# EAGLE design IoT_wall_1plug (EAGLE 7.3.0)
CNAME: RadikalBytes; CREVISION: 0.1; DESIGNER: Droky
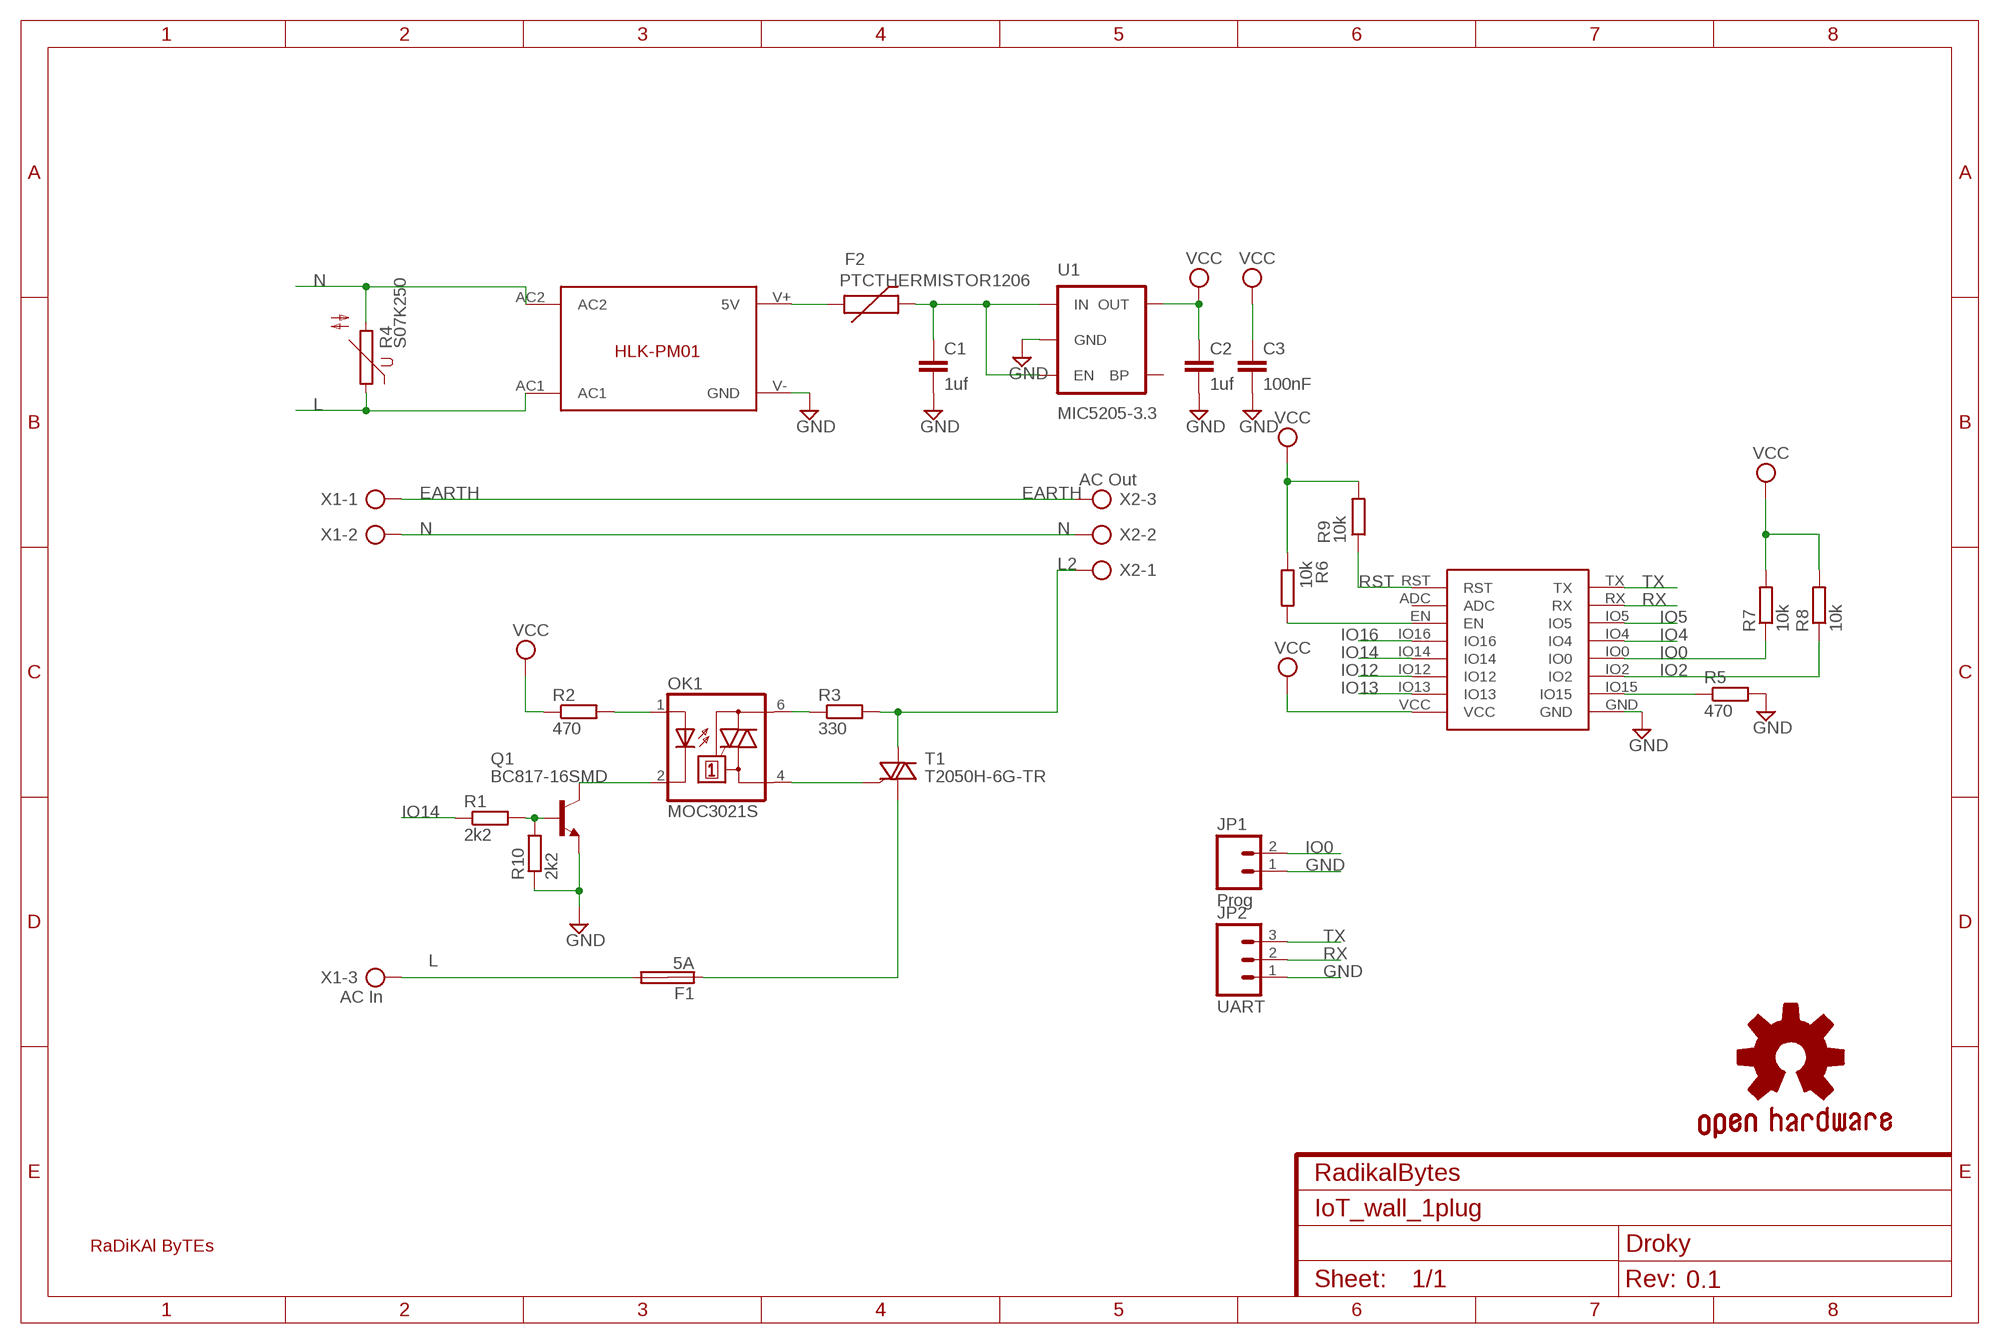
[diagram p0: schematic, sheet 1]

## Parts
C1  1uf  RCL_C-EUC0805K  [RCL_C0805K]
C2  1uf  RCL_C-EUC0805K  [RCL_C0805K]
C3  100nF  RCL_C-EUC0805K  [RCL_C0805K]
F1  5A  SHK20Q  [SHK20Q]
F2  PTCTHERMISTOR1206  SPARKFUN-POWERIC_PTCTHERMISTOR1206  [SPARKFUN-POWERIC_PTC-1206]
GOLD_ORB_SM1  OSHWLOGO_GOLD_ORB_MED  [OSHW1]
JP1  Prog  SPARKFUN-CONNECTORS_M02PTH  [SPARKFUN-CONNECTORS_1X02]
JP2  UART  SPARKFUN-CONNECTORS_M03PTH  [SPARKFUN-CONNECTORS_1X03]
OK1  MOC3021S  MOC3031S  [DIL6-SMD]
Q1  BC817-16SMD  [SOT23-BEC]
R1  2k2  R-EU_R0805  [R0805]
R2  470  R-EU_R0805  [R0805]
R3  330  R-EU_R0805  [R0805]
R4  S07K250  [S07K250]
R5  470  R-EU_R0805  [R0805]
R6  10k  R-EU_R0805  [R0805]
R7  10k  R-EU_R0805  [R0805]
R8  10k  R-EU_R0805  [R0805]
R9  10k  R-EU_R0805  [R0805]
R10  2k2  R-EU_R0805  [R0805]
T1  T2050H-6G-TR  BT136D2PACK  [D2PAK-3]
U1  MIC5205-3.3  SPARKFUN-POWERIC_V_REG_MIC52053.3V  [SPARKFUN-POWERIC_SOT23-5]
U$1  HLK-PM01  [HLK-PM01]
U$2  DAVLIB_ESP8266  [DAVLIB_ESP8266]
U$4  MI_LOGO1.5MM  [MI_LOGO_PEQUEÑO]
X1  AC In  AK500/3  [AK500/3]
X2  AC Out  AK500/3  [AK500/3]

## Nets
EARTH: X1.1 X2.3
GND: C1.2 C2.2 C3.2 JP1.1 JP2.1 Q1.E R5.2 R10.1 U1.2(GND) U$1.V-(GND) U$2.GND
IO0: JP1.2 R7.1 U$2.IO0
IO2: R8.1 U$2.IO2
IO4: U$2.IO4
IO5: U$2.IO5
IO12: U$2.IO12
IO13: U$2.IO13
IO14: R1.1 U$2.IO14
IO16: U$2.IO16
L: F1.2A R4.1 U$1.AC1 X1.3
L2: R3.2 T1.4(A2) X2.1
N: R4.2 U$1.AC2 X1.2 X2.2
N$1: Q1.B R1.2 R10.2
N$2: OK1.1(A) R2.2
N$3: OK1.6(A2) R3.1
N$4: OK1.2(C) Q1.C
N$5: F1.1A T1.1(A1)
N$6: F2.1 U$1.V+(5V)
N$7: OK1.4(A1) T1.3(G)
N$8: C1.1 F2.2 U1.1(IN) U1.3(EN)
N$10: R6.2 U$2.EN
N$12: R5.1 U$2.IO15
RST: R9.1 U$2.RST
RX: JP2.2 U$2.RX
TX: JP2.3 U$2.TX
VCC: C2.1 C3.1 R2.1 R6.1 R7.2 R8.2 R9.2 U1.5(OUT) U$2.VCC
Unconnected: F1.1B F1.2B U1.4(BP) U$2.ADC

## Library data of the parts
C1-C3 = HomeAuto:RCL_C-EU: CAPACITOR, European symbol
F1 = fuse:SHK20Q: FUSE HOLDER 5 x 20 mm, SH contact, E1207 Buerklin 64G6061; OC_FARNELL: unknown; OC_NEWARK: unknown
F2 = HomeAuto:SPARKFUN-POWERIC_PTC: Resettable Fuse PTC Resettable Fuse. Spark Fun Electronics SKU : COM-08357; PROD_ID: RES-08585
GOLD_ORB_SM1 = bfl:OSHWLOGO: These are Open-Source Hardware logos.
JP1 = HomeAuto:SPARKFUN-CONNECTORS_M02: Standard 2-pin 0.1" header. Use with - straight break away headers ( PRT-00116) - right angle break away headers (PRT-00553) - swiss pins (PRT-00743) - machine pins (PRT-00117) - female headers (PRT-00115) Molex polarized connector foot print use with: PRT-08233 with associated crimp pins and housings. 2.54_SCREWTERM for use with PRT-10571. 3.5mm Screw Terminal footprints for PRT-08084 5mm Screw Terminal footprints for use with PRT-08432
JP2 = HomeAuto:SPARKFUN-CONNECTORS_M03: Header 3 Standard 3-pin 0.1" header. Use with straight break away headers (SKU : PRT-00116), right angle break away headers (PRT-00553), swiss pins (PRT-00743), machine pins (PRT-00117), and female headers (PRT-00115). Molex polarized connector foot print use with SKU : PRT-08232 with associated crimp pins and housings.
OK1 = optocoupler:MOC30*: 6-Pin DIP Zero-Cross Optoisolators Triac Driver Output (250/400 Volt Peak) Source: Data sheet <http://www.fairchildsemi.com/ds/MO/MOC3031M.pdf> The old path of data sheet not more available 2013-05-06.; MF: FAIRCHILD SEMICONDUCTOR; MPN: MOC3031SM; OC_FARNELL: unknown; OC_NEWARK: 34C1335
Q1 = transistor-npn:BC817*: NPN Transistor
R1-R3 R5-R10 = rcl:R-EU_: RESISTOR, European symbol
R4 = varistor:S07K250: VARISTOR
T1 = triac:BT136: Triac BT136 series E sensitive gate Source: http://www.nxp.com/acrobat_download/datasheets/BT136_SERIES_E_2.pdf
U1 = HomeAuto:SPARKFUN-POWERIC_V_REG_MIC5205: V_REG MIC5205 Standard 3.3V, 5V, and Adjustable 150mA LDO voltage regulator in SOT-23 layout. Micrel part MIC5205. BP (by-pass) pin is used to lower output noise with 470pF cap, may be left open. On the adjustable version BP is used to set output.; PROD_ID: VREG-00822; VALUE: 3.3V/150mA
U$1 = davLib:HLK-PM01
U$2 = HomeAuto:DAVLIB_ESP8266
U$4 = personal:MI_LOGO
X1 X2 = con-ptr500:AK500/3: CONNECTOR; OC_FARNELL: unknown; OC_NEWARK: unknown

## Board
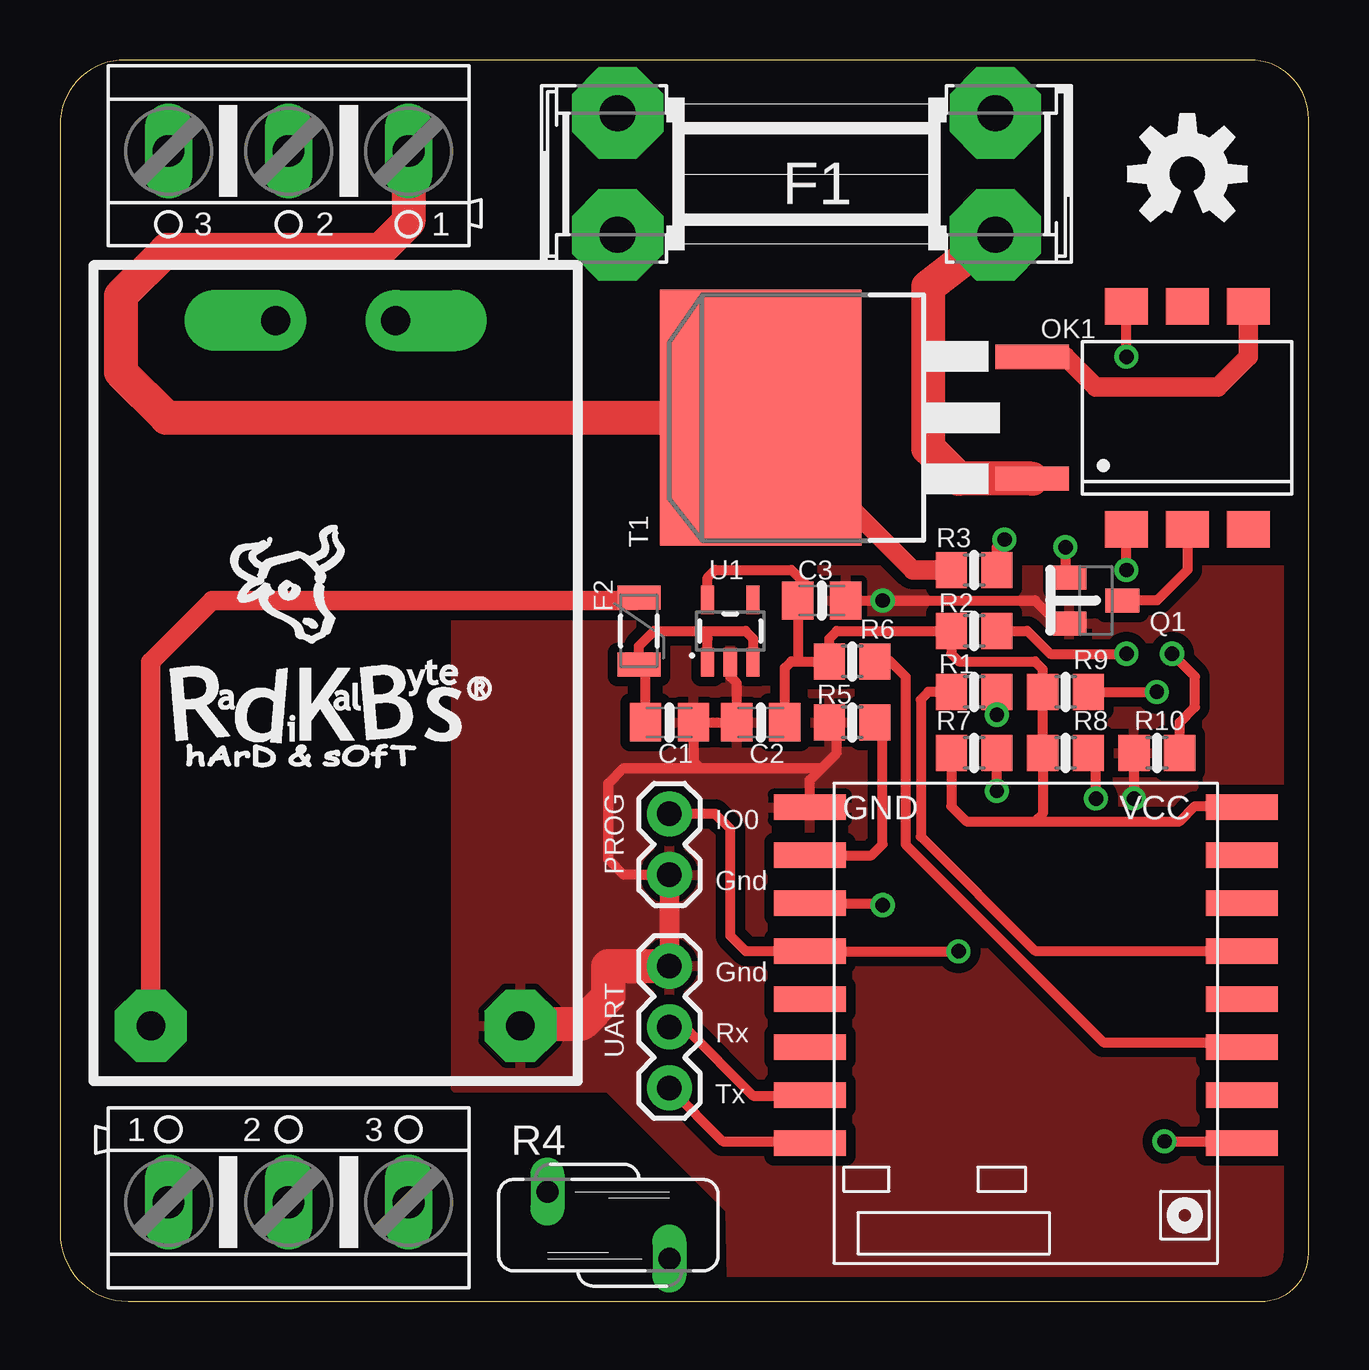
[diagram p1: board, top side]
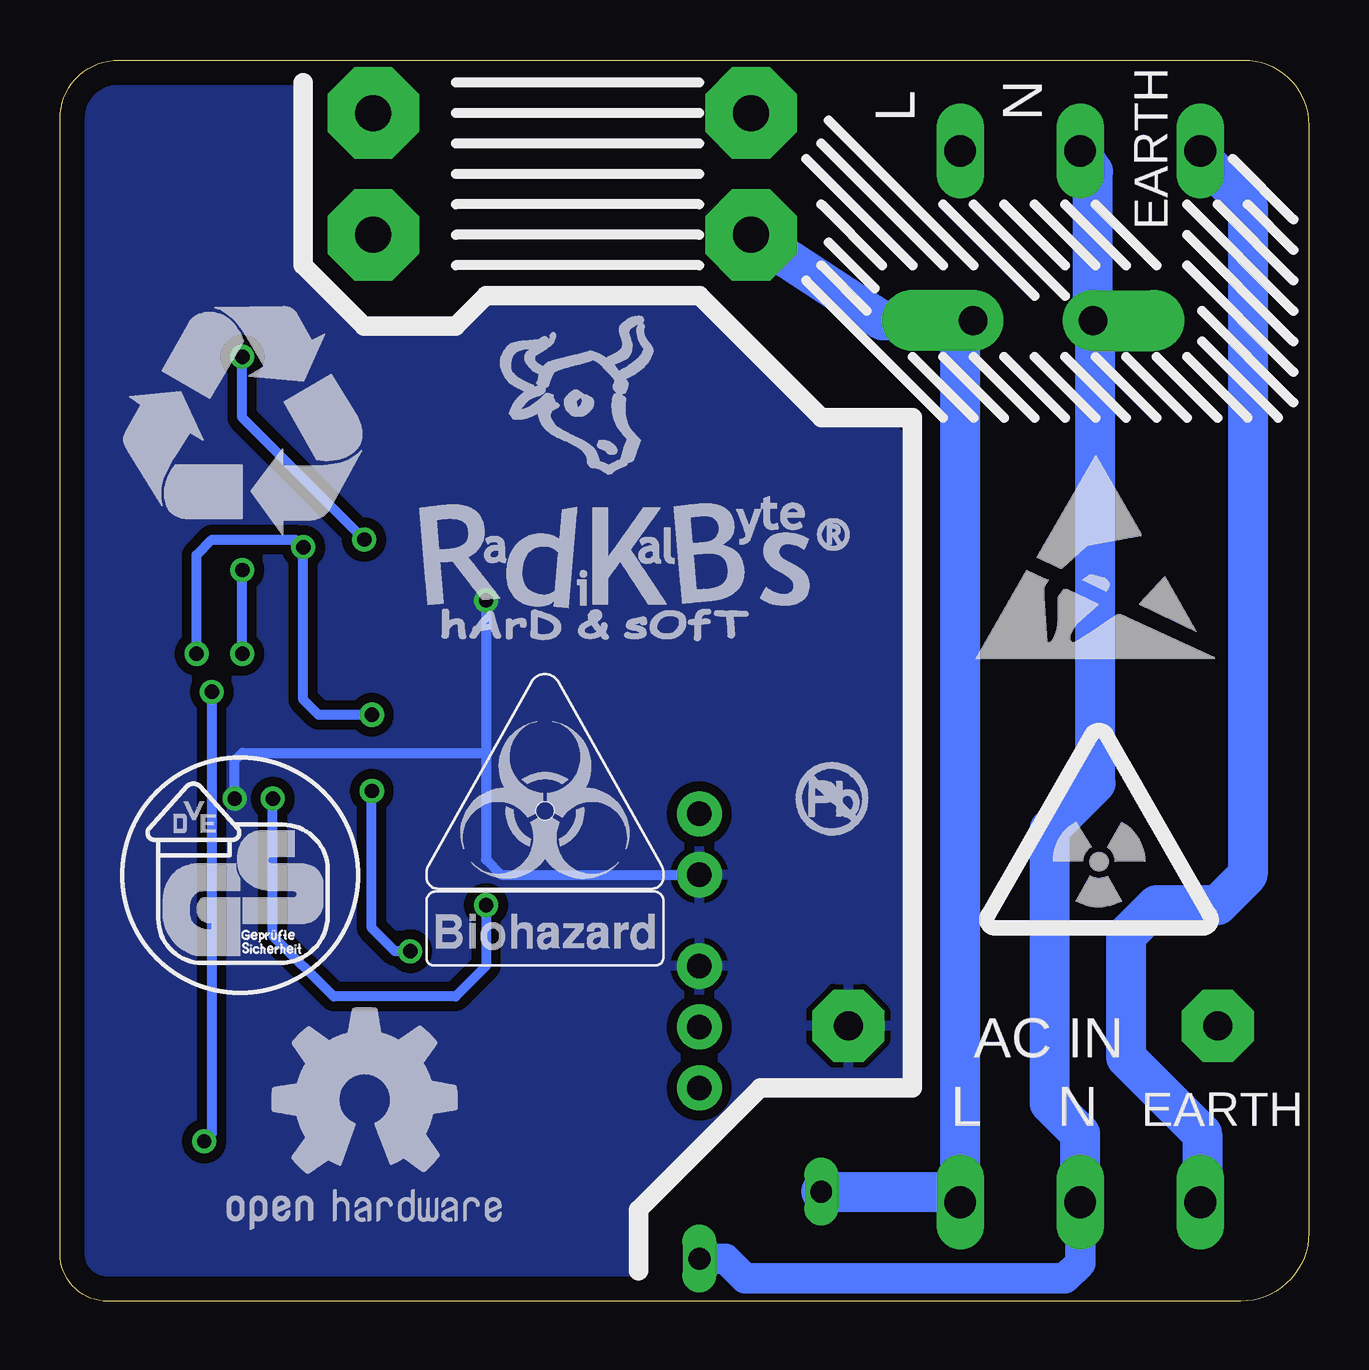
[diagram p2: board, bottom side, seen from below]

Size 52.05 x 51.74 mm. Coordinates in mm from the lower left corner, seen from the top.
Outline: 49.59,51.74 2.71,51.74 arc90 0,49.03 0,2.84 arc90 2.84,0 50.06,0 arc90 52.05,1.99 52.05,49.28 arc90 49.59,51.74
Copper layers (1*16): Top 0.035mm / dielectric 1.5mm / Bottom 0.035mm
Design rules "default": minimum track width 10mil, minimum drill 24mil, track to track 8mil, track to pad 8mil, pad to pad 8mil, via to via 8mil, smd to smd 8mil, copper to edge 40mil, drill to drill 8mil, minimum pad ring 10mil, minimum via ring 8mil, stop-mask expansion 4mil, vias tented up to drill 0mil, thermal gap 10mil

### Footprints (pad centres in the part's own frame; a part is rotated, then mirrored left to right if it is on the bottom)
RCL_C0805K = smd 1.3 x 1.6: 1 -1,0; 2 1,0
SHK20Q = drill 1.5 pad 3.81 octagon: 1A -7.874,2.54; 1B -7.874,-2.54; 2A 7.874,2.54; 2B 7.874,-2.54
SPARKFUN-POWERIC_PTC-1206 = smd 1 x 1.8: 1 -1.4,0; 2 1.4,0
SPARKFUN-CONNECTORS_1X02 = drill 1.016 pad 1.88: 1 0,0; 2 2.54,0
SPARKFUN-CONNECTORS_1X03 = drill 1.016 pad 1.88: 1 0,0; 2 2.54,0; 3 5.08,0
DIL6-SMD = smd 1.78 x 1.52: 1 -2.54,-4.645; 2 0,-4.645; 3 2.54,-4.645; 4 2.54,4.645; 5 0,4.645; 6 -2.54,4.645
SOT23-BEC = smd 1 x 1.4: B -0.95,-1.1; C 0,1.1; E 0.95,-1.1
R0805 = smd 1.3 x 1.5: 1 -0.95,0; 2 0.95,0
S07K250 = drill 0.914 long: 1 -1.397,-2.54; 2 1.397,2.54
D2PAK-3 = smd 1.016 x 3.05: 1 -2.54,-11.31; 3 2.54,-11.31 | smd 10.66 x 8.38: 4 0,0
SPARKFUN-POWERIC_SOT23-5 = smd 0.55 x 1.2: 1 -0.95,-1.3; 2 0,-1.3; 3 0.95,-1.3; 4 0.95,1.3; 5 -0.95,1.3
HLK-PM01 = drill 1.2 pad 2.54 offset: AC1 -2.56,-14.21; AC2 2.44,-14.21 | drill 1.2 pad 3 octagon: V+ 7.64,15.19; V- -7.76,15.19
DAVLIB_ESP8266 = smd 3 x 1.067: ADC -1,13; EN -1,11; GND 17,1; IO0 17,7; IO2 17,5; IO4 17,9; IO5 17,11; IO12 -1,5; IO13 -1,3; IO14 -1,7; IO15 17,3; IO16 -1,9; RST -1,15; RX 17,13; TX 17,15; VCC -1,1
AK500/3 = drill 1.321 long: 1 -5.004,0; 2 0,0; 3 5.004,0

### Placement (x,y rotation side)
C1  25.4,24.13 0 top
C2  29.21,24.13 180 top
C3  31.75,29.21 0 top
F1  31.11,46.99 180 top
F2  24.13,27.94 270 top
GOLD_ORB_SM1  45.72,1.27 0 bottom
JP1  25.4,17.78 90 top
JP2  25.4,13.97 270 top
OK1  46.99,36.83 0 top
Q1  43.18,29.21 270 top
R1  38.1,25.4 0 top
R2  38.1,27.94 0 top
R3  38.1,30.48 180 top
R4  22.86,3.17 270 top
R5  33.02,24.13 180 top
R6  33.02,26.67 0 top
R7  38.1,22.86 180 top
R8  41.91,22.86 180 top
R9  41.91,25.4 180 top
R10  45.72,22.86 0 top
T1  29.21,36.83 90 top
U1  27.94,27.94 0 top
U$1  11.43,26.67 180 top
U$2  48.26,21.59 180 top
U$3  [OSHW-LOGO-M]  46.99,46.99 0 top
U$4  3.81,21.59 0 top
U$5  [VDE-GS_10.00]  49.53,12.7 0 bottom
U$6  [RECYCLING_10.00]  49.53,31.75 0 bottom
U$7  [RADIOACTIVE_10.00]  13.97,15.24 0 bottom
U$8  [ESD_10.00]  13.97,26.67 0 bottom
U$9  [BIOHAZARD_10.00]  36.83,13.97 0 bottom
U$10  [NO_PB_LOGO_0.120]  21.59,19.05 0 bottom
U$12  [MI_LOGO_2MM]  38.1,26.67 0 bottom
X1  9.53,4.13 0 top
X2  9.53,47.94 180 top

### Tracks (layer width: path | path; a pad name or v marks a point on that pad's centre or on a via)
EARTH
  Bottom 1.676: X2.3 4.45,47.62 2.54,45.72 2.54,17.78 3.81,16.51 6.35,16.51 7.62,15.24 7.62,10.16 4.45,6.99 4.45,4.52 X1.1
GND  (via drill 0.6)
  Top 0.406: U1.2 27.94,26.04 28.21,25.77 C2.2 C1.2 26.4,22.5 26.67,22.23 | U$2.GND 31.26,21.73 31.75,22.23 | 31.75,22.23 32.38,22.86 32.38,23.82 R5.2 | JP1.1 23.5,17.78 22.86,18.41 22.86,21.59 23.5,22.23 26.67,22.23 | 26.67,22.23 31.75,22.23 | Q1.E 41.59,28.26 40.64,29.21 v34.29,29.21 C3.2 | R10.1 v44.77,20.96 v44.77,20.95
  Top 0.813: U$1.V- 19.19,11.57 | JP2.1 JP1.1
  Top 1.422: 19.19,11.57 21.73,11.57 22.86,12.7 22.86,13.97 JP2.1
  Bottom 0.406: v34.29,29.21 34.29,22.86 | 34.29,22.86 34.29,18.41 33.66,17.78 JP1.1 | v44.77,20.95 44.77,22.54 44.45,22.86 34.29,22.86
  pour Top (isolate 0.406): 52.07,0 28.03,0 27.94,3.81 22.86,8.89 16.51,8.89 16.51,30.48 52.07,30.48
  pour Bottom (isolate 0.406): 17.78,36.83 20.32,36.83 25.4,41.91 34.29,41.91 35.56,40.64 39.37,40.64 41.91,43.18 41.91,50.8 41.91,52.07 52.07,52.07 52.07,0 27.94,0 27.94,3.81 22.86,8.89 16.51,8.89 16.51,35.56
IO0  (via drill 0.6)
  Top 0.406: JP1.2 27.3,20.32 27.94,19.68 27.94,15.24 28.59,14.59 U$2.IO0 v37.45,14.59 | v39.05,21.27 R7.1
  Bottom 0.406: v37.45,14.59 38.09,14.59 39.05,15.56 v39.05,21.27
IO2  (via drill 0.6)
  Top 0.406: U$2.IO2 34.21,16.59 v34.29,16.51 | v43.18,20.95 43.18,22.54 R8.1
  Bottom 0.406: v34.29,16.51 34.29,13.97 35.56,12.7 40.64,12.7 43.18,15.24 v43.18,20.95
IO14
  Top 0.406: R1.1 36.2,25.4 35.88,25.08 35.88,19.37 40.64,14.61 49.24,14.61 U$2.IO14
L
  Bottom 1.676: U$1.AC1 15.24,40.88 | 15.24,40.88 17.77,40.88 F1.2A | X1.3 14.53,5.08 | 14.53,5.08 14.53,40.17 15.24,40.88 | R4.1 15.04,4.57 14.53,5.08
L2
  Top 0.813: R3.2 35.56,30.48 T1.4
  Top 1.422: X2.1 14.53,45.01 13.34,43.81 4.45,43.81 2.54,41.91 2.54,38.73 4.45,36.83 T1.4
N
  Bottom 1.27: R4.2 24.32,1.78 23.5,0.95 10.16,0.95 9.53,1.59 X1.2
  Bottom 1.676: X1.2 9.53,6.99 10.79,8.26 10.79,19.68 8.89,21.59 8.89,40.78 U$1.AC2 8.99,47.09 X2.2
N$1  (via drill 0.6)
  Top 0.406: R1.2 v39.05,24.45 | v41.91,31.43 41.91,30.33 Q1.B | R10.2 46.67,24.13 47.31,24.77 47.31,26.04 v46.35,26.99
  Bottom 0.406: v39.05,24.45 41.27,24.45 41.91,25.08 v41.91,31.43 42.23,31.75 45.72,31.75 46.35,31.11 v46.35,26.99
N$2  (via drill 0.6)
  Top 0.406: R2.2 40.32,27.94 41.27,26.99 v44.45,26.99 | v44.45,30.48 OK1.1
  Bottom 0.406: v44.45,26.99 v44.45,30.48
N$3  (via drill 0.6)
  Top 0.406: R3.1 39.05,31.43 v39.37,31.75 | v44.45,39.37 OK1.6
  Bottom 0.406: v39.37,31.75 44.45,36.83 v44.45,39.37
N$4
  Top 0.406: OK1.2 46.99,30.48 45.72,29.21 Q1.C
N$5
  Top 1.422: T1.1 37.47,34.29 36.2,35.56 36.2,42.29 F1.1A
N$6
  Top 0.813: U$1.V+ 3.79,26.65 6.35,29.21 24,29.21 F2.1
N$7
  Top 0.813: T1.3 41.91,39.37 43.18,38.1 48.26,38.1 49.53,39.37 OK1.4
N$8
  Top 0.406: C1.1 24.4,26.27 F2.2 24.13,27.3 24.77,27.94 26.67,27.94 | 26.67,27.94 28.57,27.94 28.89,27.62 U1.3 | U1.1 26.99,27.62 26.67,27.94
N$10
  Top 0.406: R6.2 34.61,26.67 35.24,26.04 35.24,19.05 43.5,10.79 49.05,10.79 U$2.EN
N$12
  Top 0.406: U$2.IO15 33.83,18.59 34.29,19.05 34.29,23.81 R5.1
RST  (via drill 0.6)
  Top 0.406: R9.1 v45.72,25.4 | v46.04,6.67 49.18,6.67 U$2.RST
  Bottom 0.406: v45.72,25.4 45.72,6.99 v46.04,6.67
RX
  Top 0.406: JP2.2 26.04,11.43 28.89,8.57 31.24,8.57 U$2.RX
TX
  Top 0.406: JP2.3 27.62,6.67 31.18,6.67 U$2.TX
VCC
  Top 0.406: C2.1 30.21,26.4 30.48,26.67 30.8,26.67 | 30.8,26.67 R6.1 32.07,27.62 32.38,27.94 R2.1 37.15,26.98 37.47,26.67 40.64,26.67 40.96,26.35 R9.2 R8.2 40.96,20.32 40.64,20 | U1.5 26.99,30.16 27.3,30.48 30.48,30.48 31.11,29.84 31.11,29.57 C3.1 30.75,26.72 30.8,26.67 | R7.2 37.15,20.64 37.78,20 40.64,20 | 40.64,20 46.67,20 47.31,20.64 49.21,20.64 U$2.VCC

### Text on the board
tPlace: IO0 | Gnd | Gnd | Rx | Tx
bPlace: EARTH | L | N | AC IN | EARTH | N | L
tNames: PROG | UART